# EAGLE schematic myduino_v1 (EAGLE 6.4)
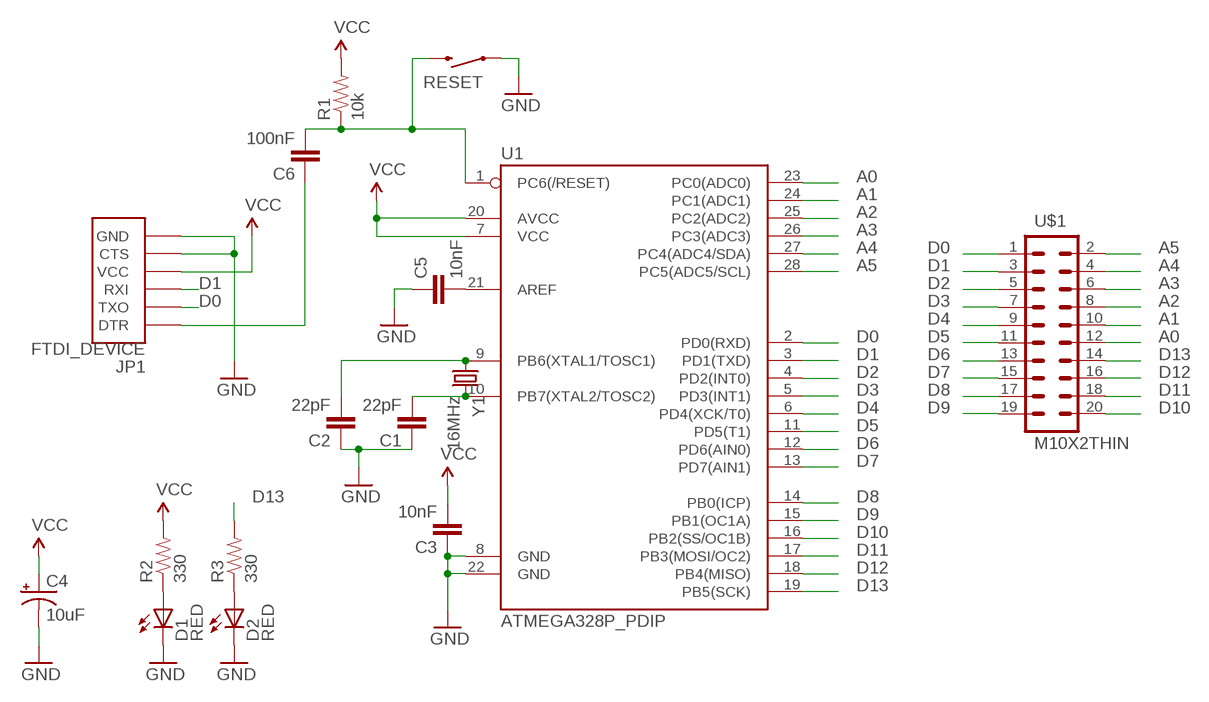
[diagram p0: schematic, sheet 1]

## Parts
C1  22pF  10NF-CER  [0402-CAP]
C2  22pF  10NF-CER  [0402-CAP]
C3  10nF  10NF-CER  [0402-CAP]
C4  10uF  10UF-TANT  [EIA3216]
C5  10nF  10NF-CER  [0402-CAP]
C6  100nF  10NF-CER  [0402-CAP]
D1  RED  LED-RED0603  [LED-0603]
D2  RED  LED-RED0603  [LED-0603]
JP1  FTDI_DEVICE  [FTDI_DEVICE_SIDE]
R1  10k  RESISTOR0603  [0603-RES]
R2  330  RESISTOR0603  [0603-RES]
R3  330  RESISTOR0603  [0603-RES]
RESET  SWITCH-MOMENTARY-2PTH  [TACTILE-PTH]
U1  ATMEGA328P_PDIP  [DIL28-3]
U$1  M10X2THIN  [2X10_THIN]
Y1  16MHz  CRYSTALHC49US  [HC49US]

## Nets
A0: U1.23(PC0(ADC0)) U$1.12
A1: U1.24(PC1(ADC1)) U$1.10
A2: U1.25(PC2(ADC2)) U$1.8
A3: U1.26(PC3(ADC3)) U$1.6
A4: U1.27(PC4(ADC4/SDA)) U$1.4
A5: U1.28(PC5(ADC5/SCL)) U$1.2
D0: JP1.P$2(TXO) U1.2(PD0(RXD)) U$1.1
D1: JP1.P$3(RXI) U1.3(PD1(TXD)) U$1.3
D2: U1.4(PD2(INT0)) U$1.5
D3: U1.5(PD3(INT1)) U$1.7
D4: U1.6(PD4(XCK/T0)) U$1.9
D5: U1.11(PD5(T1)) U$1.11
D6: U1.12(PD6(AIN0)) U$1.13
D7: U1.13(PD7(AIN1)) U$1.15
D8: U1.14(PB0(ICP)) U$1.17
D9: U1.15(PB1(OC1A)) U$1.19
D10: U1.16(PB2(SS/OC1B)) U$1.20
D11: U1.17(PB3(MOSI/OC2)) U$1.18
D12: U1.18(PB4(MISO)) U$1.16
D13: R3.2 U1.19(PB5(SCK)) U$1.14
GND [power]: C1.1 C2.1 C3.1 C4.C(-) C5.1 D1.C D2.C JP1.P$5(CTS) JP1.P$6(GND) RESET.1 U1.8(GND) U1.22(GND)
N$1: D2.A R3.1
N$2: C1.2 U1.10(PB7(XTAL2/TOSC2)) Y1.2
N$3: C2.2 U1.9(PB6(XTAL1/TOSC1)) Y1.1
N$5: C5.2 U1.21(AREF)
N$24: C6.2 R1.1 RESET.3 U1.1(PC6(/RESET))
N$25: D1.A R2.1
N$26: C6.1 JP1.P$1(DTR)
VCC [power]: C3.2 C4.A(+) JP1.P$4(VCC) R1.2 R2.2 U1.7(VCC) U1.20(AVCC)

## Library data of the parts
C1 C2 C6 = SparkFun-Capacitors:10NF-CER: 10nF/.01uF/10000pF ceramic SMT CAP-00867- 50V 10% (0603); PROD_ID: CAP-00867; VALUE: 10nF
C3 C5 = SparkFun-Capacitors:10NF-CER: 10nF/.01uF/10000pF ceramic SMT CAP-00867- 50V 10% (0603); PROD_ID: CAP-00867
C4 = SparkFun-Capacitors:10UF-TANT: 10uF Tantalum SMT CAP-00811- 16V 10% (EIA-3216); PROD_ID: CAP-00811
D1 D2 = SparkFun-LED:LED-RED: Assorted Red LEDs LilyPad 1206- DIO-09912 1206- DIO-00809 0603- DIO-00819; PROD_ID: DIO-00819
JP1 = SparkFun-Connectors:FTDI_DEVICE: Connector which mates to FTDI basic or FTDI cable.
R1-R3 = SparkFun-Resistors:RESISTOR: Resistor Basic schematic elements and footprints for 0603, 1206, and PTH resistors.
RESET = SparkFun-Electromechanical:SWITCH-MOMENTARY-2: Various NO switches- pushbuttons, reed, etc
U1 = SparkFun-DigitalIC:ATMEGA328P_PDIP: uC used in the Arduino 32kb flash, 1k EEPROM, 2k SRAM This is the through-hole version of this chip.
U$1 = kmod:M10X2: This was SPECIALLY designed to be used with our Graphic LCD Backpack. Be sure you want to use this! It is not only staggered on each line of header holes, but IT IS ALSO offset of the center point of the top and bottom lines by 5 mil. This causes the headers to lock into place on the "standard" footprint on the LCD screen. The extra squares on the tdocu layer are there simply to reference other pins (if you were to actually populate a longer header than ten long - this is what we do with the backpacks).
Y1 = SparkFun-FreqCtrl:CRYSTAL: Various standard crystals. Proven footprints. Spark Fun Electronics SKU : COM-00534

## Net classes
1 power: width 0.381 mm, clearance 0.254 mm